# EAGLE design CP2102-USB (EAGLE 5.06)
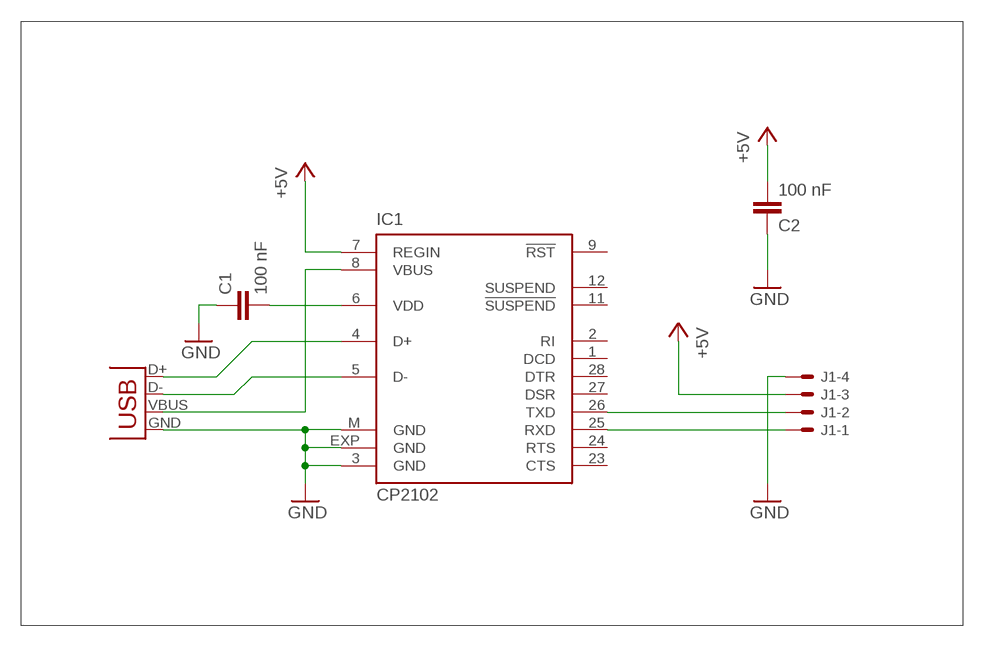
[diagram p0: schematic, sheet 1]

## Parts
C1  100 nF  C-EUC0805  [C0805]
C2  100 nF  C-EUC0805  [C0805]
IC1  CP2102  [MLP28]
J1  22-27-2041-04  [6410-04]
X1  USBPTH  [USB-B-PTH]

## Nets
+5V: C2.2 IC1.7(REGIN) J1.3
GND: C1.1 C2.1 IC1.3(GND) IC1.EXP(GND) IC1.M(GND) J1.4 X1.GND
N$1: IC1.4(D+) X1.D+
N$3: IC1.26(TXD) J1.2
N$4: IC1.25(RXD) J1.1
N$6: IC1.5(D-) X1.D-
N$10: C1.2 IC1.6(VDD)
N$13: IC1.8(VBUS) X1.VBUS
Unconnected: IC1.1(DCD) IC1.2(RI) IC1.9(!RST) IC1.11(!SUSPEND) IC1.12(SUSPEND) IC1.23(CTS) IC1.24(RTS) IC1.27(DSR) IC1.28(DTR)

## Library data of the parts
C1 C2 = rcl:C-EU: CAPACITOR, European symbol
IC1 = silabs:CP210*: Single-Chip USB to UART Bridge Source: www.silabs.com .. CP2101.pdf / cp2102.pdf
J1 = con-molex:22-?-04: CONNECTOR wire to board 2.54 mm (.1 inch) pitch header
X1 = SparkFun:USB: USB Connectors USB-B-PTH is fully proven SKU : PRT-00139 USB-miniB is fully proven SKU : PRT-00587 USB-A-PCB is untested. USB-A-H is throughly reviewed, but untested. Spark Fun Electronics SKU : PRT-00437 USB-B-SMT is throughly reviewed, but untested. Needs silkscreen touching up. USB-A-S has not been used/tested USB-MB-H has not been used/tested

## Board
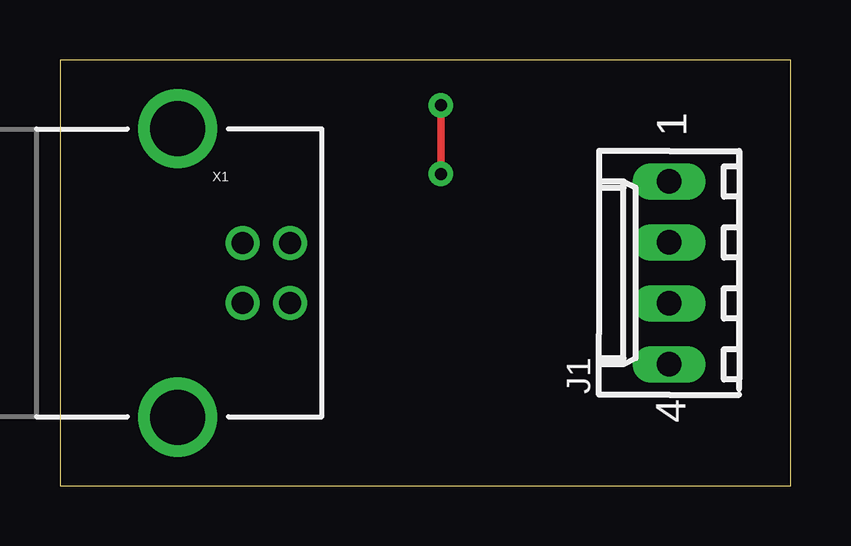
[diagram p1: board, top side]
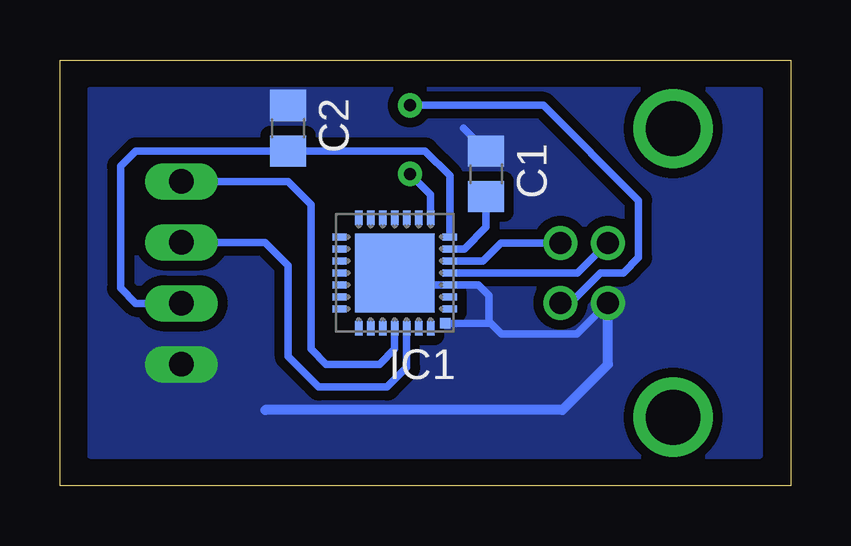
[diagram p2: board, bottom side, seen from below]

Size 30.47 x 17.77 mm. Coordinates in mm from the lower left corner, seen from the top.
Outline: 0,0 30.47,0 30.47,17.77 0,17.77 0,0
Copper layers (1*16): Top 0.035mm / dielectric 1.5mm / Bottom 0.035mm
Design rules "default": minimum track width 10mil, minimum drill 24mil, track to track 8mil, track to pad 8mil, pad to pad 8mil, via to via 8mil, smd to smd 8mil, copper to edge 40mil, drill to drill 8mil, minimum pad ring 10mil, minimum via ring 8mil, stop-mask expansion 4mil, vias tented up to drill 0mil, thermal gap 10mil

### Footprints (pad centres in the part's own frame; a part is rotated, then mirrored left to right if it is on the bottom)
C0805 = smd 1.3 x 1.5: 1 -0.95,0; 2 0.95,0
MLP28 = smd 0.6 x 0.3: 1 -2.3,1.5; 2 -2.3,1; 3 -2.3,0.5; 4 -2.3,0; 5 -2.3,-0.5; 6 -2.3,-1; 7 -2.3,-1.5; 15 2.3,-1.5; 16 2.3,-1; 17 2.3,-0.5; 18 2.3,0; 19 2.3,0.5; 20 2.3,1; 21 2.3,1.5 | smd 0.3 x 0.6: 8 -1.5,-2.3; 9 -1,-2.3; 10 -0.5,-2.3; 11 0,-2.3; 12 0.5,-2.3; 13 1,-2.3; 14 1.5,-2.3; 22 1.5,2.3; 23 1,2.3; 24 0.5,2.3; 25 0,2.3; 26 -0.5,2.3; 27 -1,2.3; 28 -1.5,2.3 | smd 3.3 x 3.3: EXP 0,0 | smd 0.435 x 0.435: M -2.103,2.103
6410-04 = drill 1.016 long: 1 3.81,0; 2 1.27,0; 3 -1.27,0; 4 -3.81,0
USB-B-PTH = drill 0.914 round: D+ 0,1.25; D- 1.981,1.25; GND 0,-1.25; VBUS 1.981,-1.25 | drill 2.286 round: P$1 -2.718,-6.02; P$2 -2.718,6.02

### Placement (x,y rotation side)
C1  12.7,13.02 270 bottom
C2  20.96,14.92 270 bottom
IC1  16.51,8.89 180 bottom
J1  25.4,8.89 90 top
X1  7.62,8.89 0 top

### Tracks (layer width: path | path; a pad name or v marks a point on that pad's centre or on a via)
+5V
  Bottom 0.305: J1.3 27.3,7.62 27.94,8.26 27.94,13.34 27.3,13.97 21.91,13.97 C2.2 21.91,13.97 15.24,13.97 14.21,12.94 IC1.7
GND
  Bottom 0.305: 12.58,6.79 IC1.M | IC1.EXP 16.01,8.39 IC1.3 13.02,8.39 12.58,7.95 12.58,6.79 | 12.58,6.79 12.5,6.79 12.06,6.35 8.91,6.35 X1.GND | C1.1 13.65,14.92
  Bottom 0.406: 21.91,3.18 9.53,3.18 7.62,5.08 X1.GND
  pour Bottom (isolate 0.406, no thermals): 1.27,16.51 29.21,16.51 29.21,1.27 1.27,1.27
N$1
  Bottom 0.305: X1.D+ 7.64,10.14 8.89,8.89 IC1.4
N$3
  Bottom 0.305: IC1.26 16.01,4.95 16.83,4.13 19.69,4.13 20.95,5.4 20.95,9.21 21.91,10.16 J1.2
N$4
  Bottom 0.305: IC1.25 16.51,5.71 17.15,5.08 19.37,5.08 20,5.71 20,11.75 20.95,12.7 J1.1
N$6
  Bottom 0.305: X1.D- 12.08,10.14 12.83,9.39 IC1.5
N$10
  Bottom 0.305: IC1.6 13.6,9.89 12.7,10.79 C1.2
N$13  (via drill 0.5 pad 1.02)
  Top 0.305: v15.88,15.88 v15.88,13.02
  Bottom 0.305: X1.VBUS 9.19,7.64 7.94,8.89 6.99,8.89 6.35,9.53 6.35,11.91 10.32,15.88 v15.88,15.88 | IC1.8 15.01,12.15 v15.88,13.02